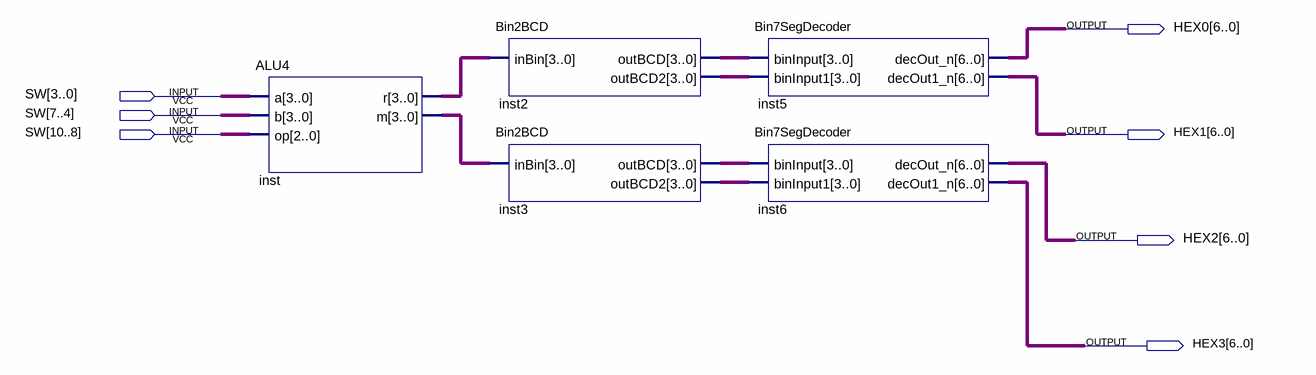
[diagram p0: schematic sheet]
// Quartus schematic ALUDemo.bdf as structural Verilog: 5 symbols, 7 pins
module ALUDemo (
  input  [10:0] SW,
  output [6:0] HEX0,
  output [6:0] HEX1,
  output [6:0] HEX2,
  output [6:0] HEX3
);

  wire [3:0] inst2_outbcd, inst2_outbcd2, inst3_outbcd, inst3_outbcd2, inst_m, inst_r;

  ALU4 inst (.a(SW[3:0]), .b(SW[7:4]), .op(SW[10:8]), .r(inst_r), .m(inst_m));
  Bin2BCD inst2 (.inBin(inst_r), .outBCD(inst2_outbcd), .outBCD2(inst2_outbcd2));
  Bin2BCD inst3 (.inBin(inst_m), .outBCD(inst3_outbcd), .outBCD2(inst3_outbcd2));
  Bin7SegDecoder inst5 (.binInput(inst2_outbcd), .binInput1(inst2_outbcd2), .decOut_n(HEX0), .decOut1_n(HEX1));
  Bin7SegDecoder inst6 (.binInput(inst3_outbcd), .binInput1(inst3_outbcd2), .decOut_n(HEX2), .decOut1_n(HEX3));
endmodule
